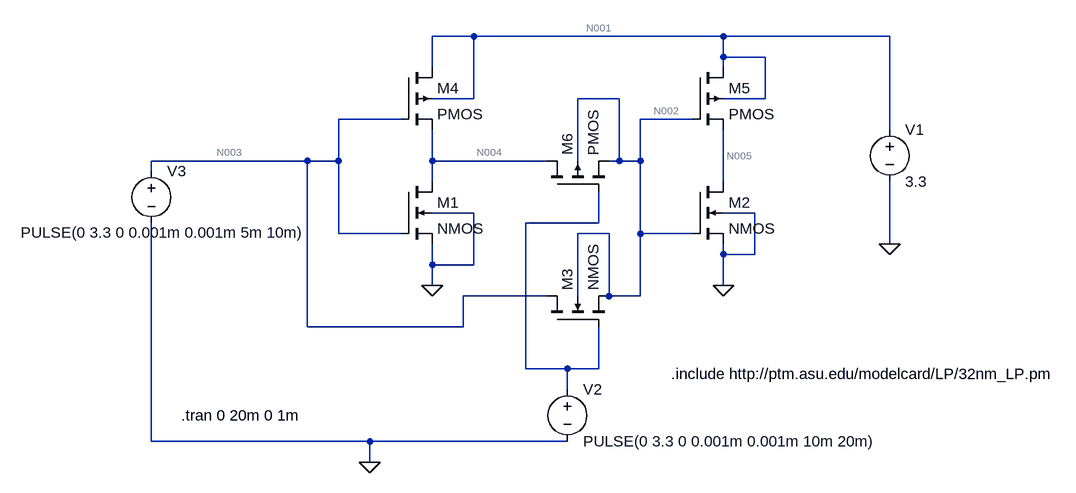
[diagram p0: schematic xor_pass.asc]
xor_pass.asc, the LTspice schematic file:
Version 4
SHEET 1 880 680
WIRE -320 -400 -384 -400
WIRE 64 -400 -320 -400
WIRE 320 -400 64 -400
WIRE 64 -368 64 -400
WIRE 128 -368 64 -368
WIRE -384 -352 -384 -400
WIRE 64 -352 64 -368
WIRE -320 -304 -320 -400
WIRE -320 -304 -384 -304
WIRE -96 -304 -160 -304
WIRE 128 -304 128 -368
WIRE 128 -304 64 -304
WIRE -432 -272 -528 -272
WIRE 16 -272 -64 -272
WIRE 320 -256 320 -400
WIRE -576 -208 -816 -208
WIRE -528 -208 -528 -272
WIRE -528 -208 -576 -208
WIRE -384 -208 -384 -256
WIRE -208 -208 -384 -208
WIRE -160 -208 -160 -304
WIRE -96 -208 -96 -304
WIRE -96 -208 -112 -208
WIRE -64 -208 -64 -272
WIRE -64 -208 -96 -208
WIRE -816 -192 -816 -208
WIRE -384 -176 -384 -208
WIRE 64 -176 64 -256
WIRE -320 -128 -384 -128
WIRE 112 -128 64 -128
WIRE -128 -112 -128 -160
WIRE -128 -112 -240 -112
WIRE -528 -96 -528 -208
WIRE -432 -96 -528 -96
WIRE -112 -96 -160 -96
WIRE -64 -96 -64 -208
WIRE 16 -96 -64 -96
WIRE 320 -80 320 -176
WIRE 64 -64 64 -80
WIRE 112 -64 112 -128
WIRE 112 -64 64 -64
WIRE -384 -48 -384 -80
WIRE -320 -48 -320 -128
WIRE -320 -48 -384 -48
WIRE -384 -16 -384 -48
WIRE 64 -16 64 -64
WIRE -208 0 -336 0
WIRE -160 0 -160 -96
WIRE -112 0 -112 -96
WIRE -64 0 -64 -96
WIRE -64 0 -112 0
WIRE -576 48 -576 -208
WIRE -336 48 -336 0
WIRE -336 48 -576 48
WIRE -240 112 -240 -112
WIRE -176 112 -240 112
WIRE -128 112 -128 48
WIRE -128 112 -176 112
WIRE -176 144 -176 112
WIRE -816 224 -816 -112
WIRE -480 224 -816 224
WIRE -176 224 -480 224
WIRE -480 256 -480 224
FLAG -384 -16 0
FLAG 64 -16 0
FLAG 320 -80 0
FLAG -480 256 0
SYMBOL nmos4 -432 -176 R0
SYMATTR InstName M1
SYMATTR Value2 l=32n w=1u
SYMBOL nmos4 16 -176 R0
SYMATTR InstName M2
SYMATTR Value2 l=32n w=1u
SYMBOL pmos4 -432 -352 R0
SYMATTR InstName M4
SYMATTR Value2 l=32n w=1u
SYMBOL pmos4 16 -352 R0
SYMATTR InstName M5
SYMATTR Value2 l=32n w=1u
SYMBOL pmos4 -208 -160 R270
SYMATTR InstName M6
SYMATTR Value2 l=32n w=1u
SYMBOL voltage 320 -272 R0
WINDOW 123 0 0 Left 0
WINDOW 39 0 0 Left 0
SYMATTR InstName V1
SYMATTR Value 3.3
SYMBOL voltage -176 128 R0
WINDOW 123 0 0 Left 0
WINDOW 39 0 0 Left 0
SYMATTR InstName V2
SYMATTR Value PULSE(0 3.3 0 0.001m 0.001m 10m 20m)
SYMBOL voltage -816 -208 R0
WINDOW 3 -201 110 Left 2
WINDOW 123 0 0 Left 0
WINDOW 39 0 0 Left 0
SYMATTR InstName V3
SYMATTR Value PULSE(0 3.3 0 0.001m 0.001m 5m 10m)
SYMBOL nmos4 -208 48 R270
SYMATTR InstName M3
TEXT -770 184 Left 2 !.tran 0 20m 0 1m
TEXT -16 120 Left 2 !.include http://ptm.asu.edu/modelcard/LP/32nm_LP.pm

The netlist it stands for:
* xor_pass.asc
M1 N004 N003 0 0 NMOS l=32n w=1u
M2 N005 N002 0 0 NMOS l=32n w=1u
M4 N001 N003 N004 N001 PMOS l=32n w=1u
M5 N001 N002 N005 N001 PMOS l=32n w=1u
M6 N004 N006 N002 N002 PMOS l=32n w=1u
V1 N001 0 3.3
V2 N006 0 PULSE(0 3.3 0 0.001m 0.001m 10m 20m)
V3 N003 0 PULSE(0 3.3 0 0.001m 0.001m 5m 10m)
M3 N003 N006 N002 N002 NMOS
.model NMOS NMOS
.model PMOS PMOS
.lib standard.mos
.tran 0 20m 0 1m
.include http://ptm.asu.edu/modelcard/LP/32nm_LP.pm
.backanno
.end

* Results of the author's LTspice run, read from the files saved beside the schematic
* Operating Point, zero values left out:
*   V(n004) = 1.386 V
*   V(n005) = 2.332 V
*   V(n002) = 700.6 mV
*   V(n001) = 3.3 V
*   Id(M6) = 2.515 mA
*   Ig(M6) = -908.5 pA
*   Ib(M6) = -1.783 mA
*   Is(M6) = -732 µA
*   Id(M5) = 1.418 mA
*   Ig(M5) = -23.14 µA
*   Ib(M5) = 23.09 µA
*   Is(M5) = -1.418 mA
*   Id(M4) = 2.515 mA
*   Ig(M4) = -5.769 mA
*   Ib(M4) = 5.769 mA
*   Is(M4) = -2.515 mA
*   Id(M3) = -2.538 mA
*   Ig(M3) = -132.7 nA
*   Ib(M3) = 2.538 mA
*   Is(M3) = 140.2 pA
*   Id(M2) = 1.418 mA
*   Ig(M2) = 27.67 pA
*   Ib(M2) = -1.091 mA
*   Is(M2) = -326.6 µA
*   Id(M1) = 911.9 pA
*   Ib(M1) = -820.5 pA
*   Is(M1) = -91.45 pA
*   I(V3) = 8.307 mA
*   I(V2) = 133.6 nA
*   I(V1) = -9.725 mA
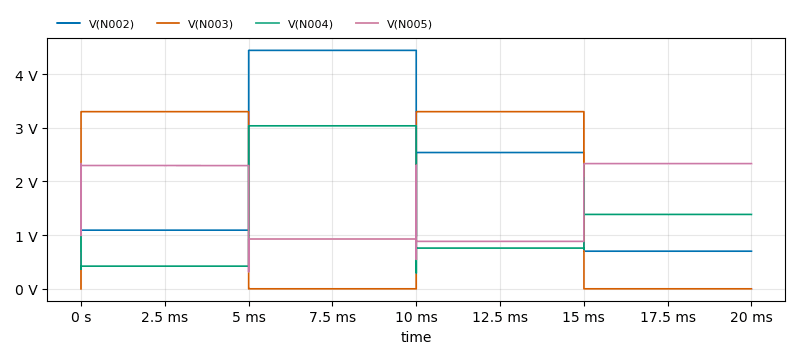
[diagram p1: Transient Analysis of xor_pass.asc, plotted from the saved traces]
* Transient Analysis, 1 run:
*   V(N002): min 700.6 mV, max 4.442 V, average 2.193 V, rms 2.639 V, last 700.6 mV
*   V(N003): min 0 V, max 3.3 V, average 1.65 V, rms 2.334 V, last 0 V
*   V(N004): min 292.3 mV, max 3.036 V, average 1.4 V, rms 1.724 V, last 1.386 V
*   V(N005): min 313.1 mV, max 2.332 V, average 1.61 V, rms 1.758 V, last 2.332 V